# EAGLE design croky_b_1.6_maxi (EAGLE 9.6.1)
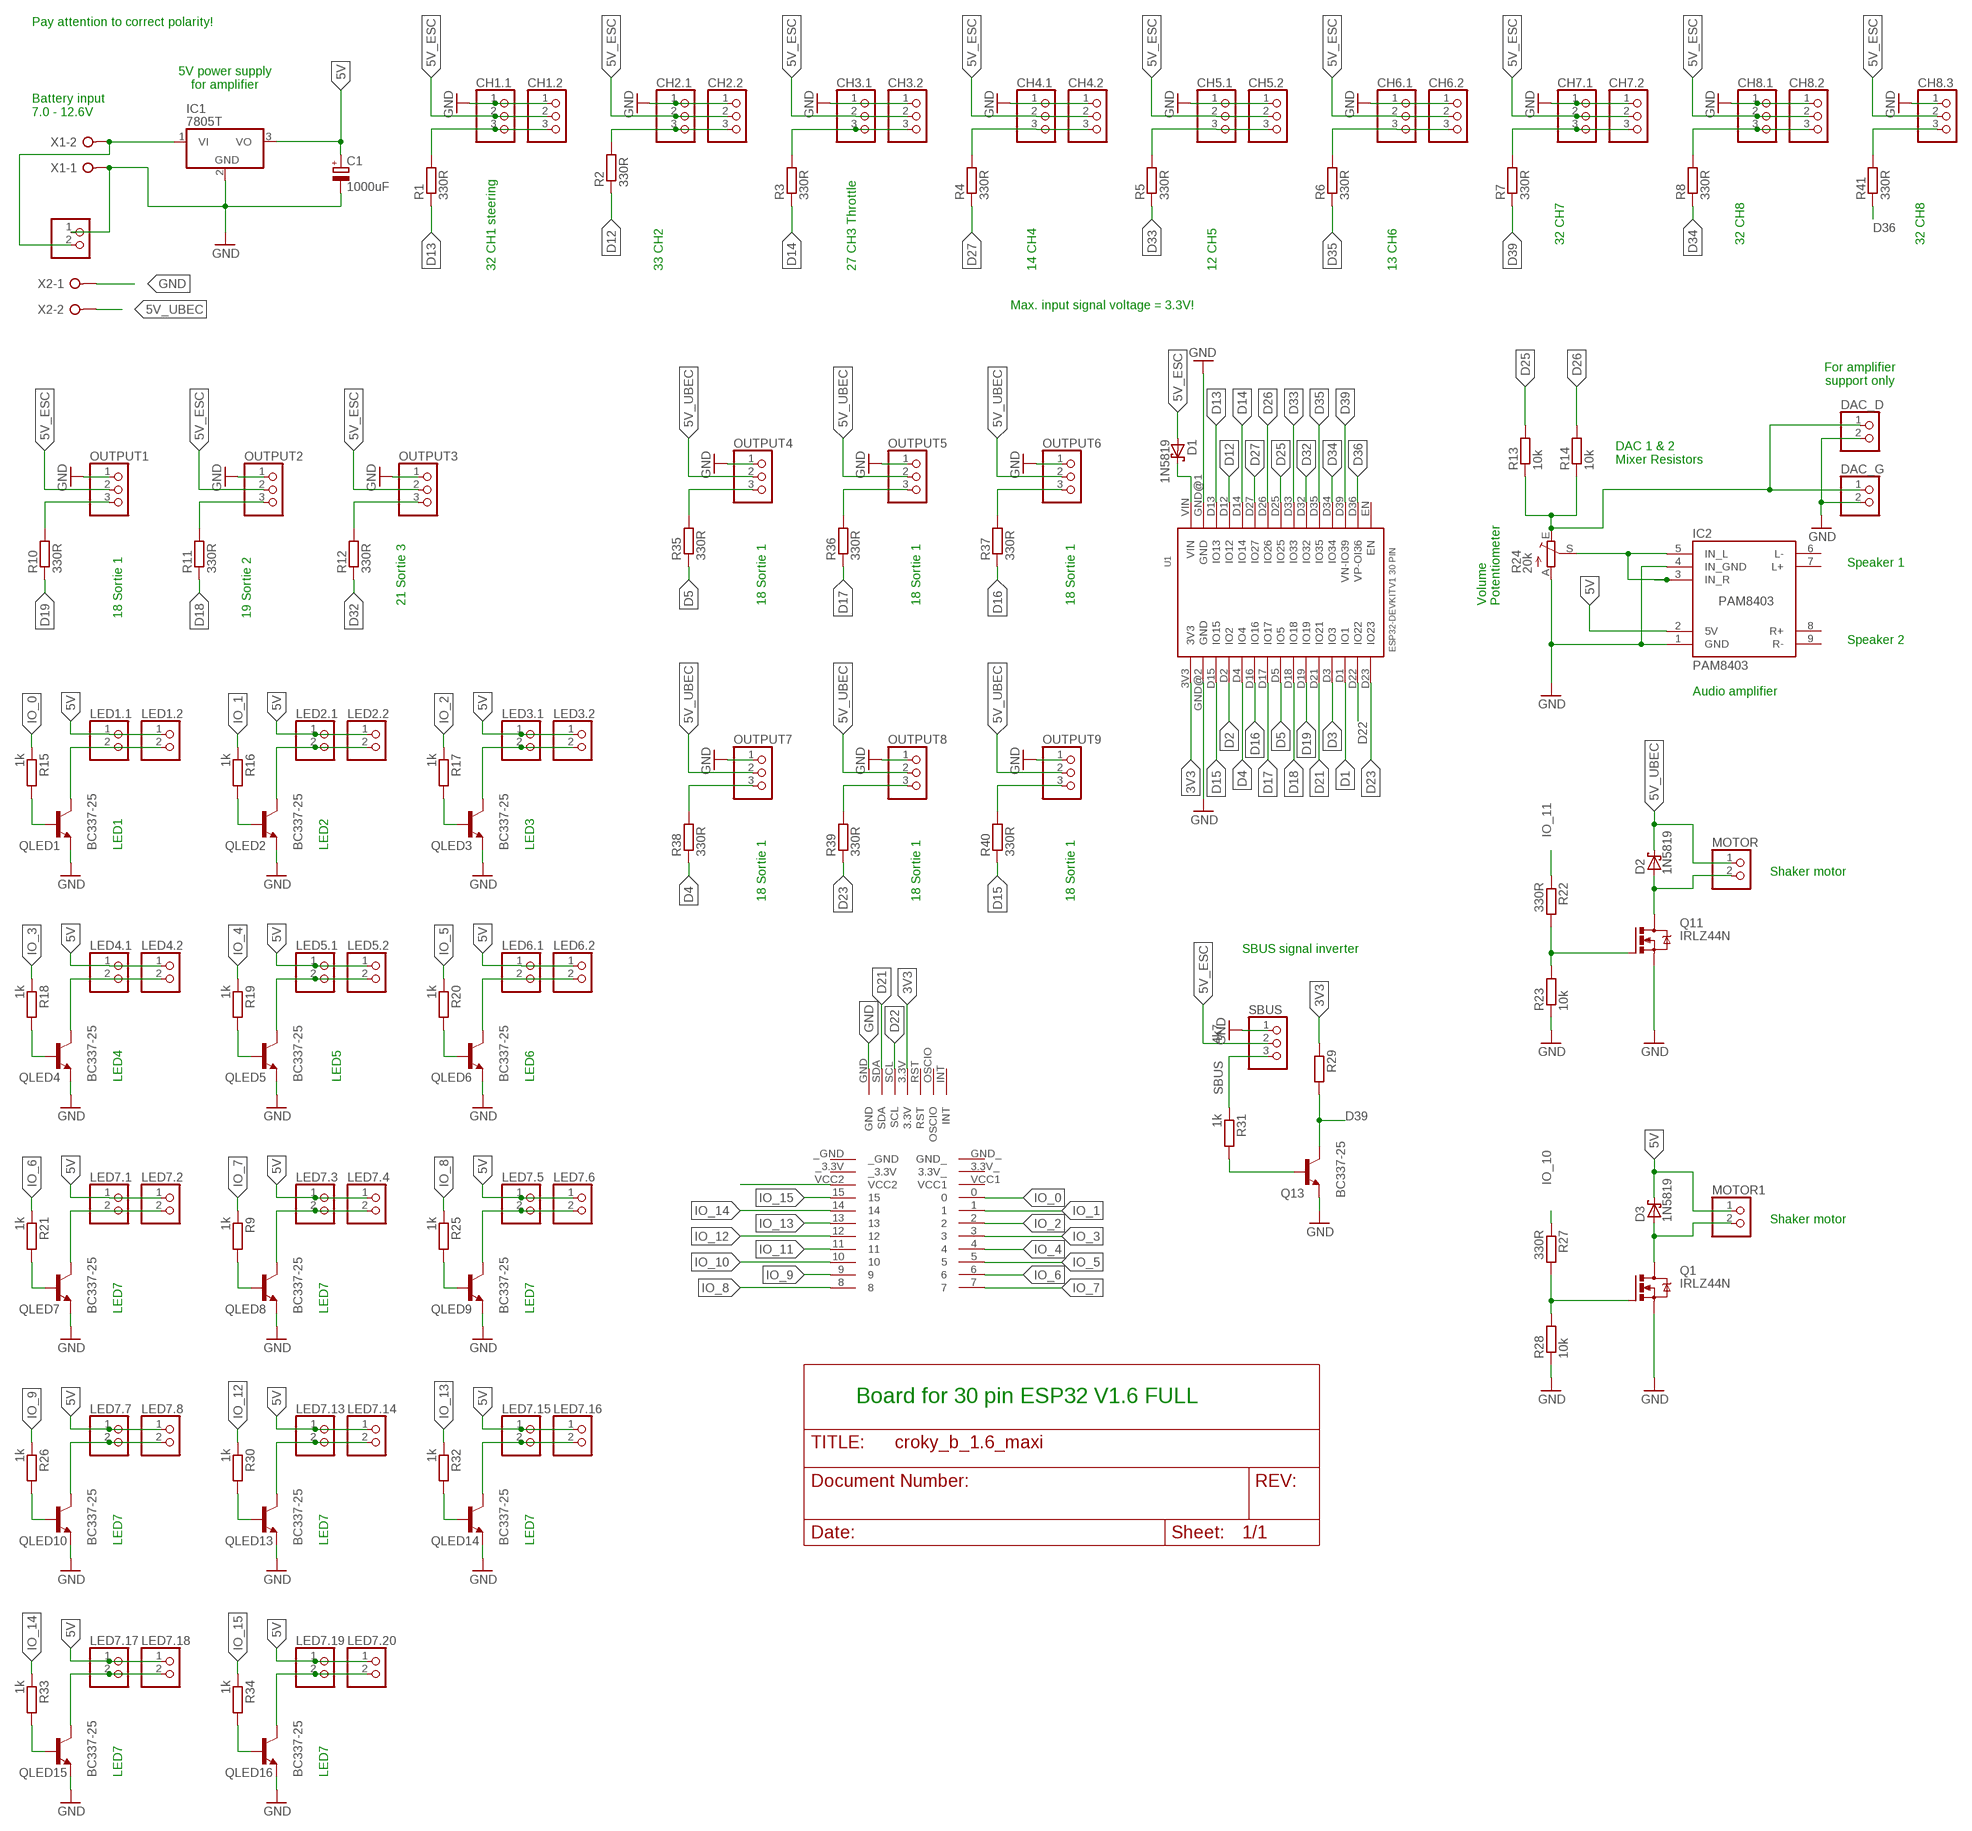
[diagram p0: schematic, sheet 1]

## Parts
C1  1000uF  CPOL-EUE5-10.5  [E5-10,5]
CH1.1  PINHD-1X3  [1X03]
CH1.2  PINHD-1X3  [1X03]
CH2.1  PINHD-1X3  [1X03]
CH2.2  PINHD-1X3  [1X03]
CH3.1  PINHD-1X3  [1X03]
CH3.2  PINHD-1X3  [1X03]
CH4.1  PINHD-1X3  [1X03]
CH4.2  PINHD-1X3  [1X03]
CH5.1  PINHD-1X3  [1X03]
CH5.2  PINHD-1X3  [1X03]
CH6.1  PINHD-1X3  [1X03]
CH6.2  PINHD-1X3  [1X03]
CH7.1  PINHD-1X3  [1X03]
CH7.2  PINHD-1X3  [1X03]
CH8.1  PINHD-1X3  [1X03]
CH8.2  PINHD-1X3  [1X03]
CH8.3  PINHD-1X3  [1X03]
D1  1N5819  SCHOTTKY-DIODEDO35-7  [DO35-7]
D2  1N5819  SCHOTTKY-DIODEDO35-7  [DO35-7]
D3  1N5819  SCHOTTKY-DIODEDO35-7  [DO35-7]
DAC_D  PINHD-1X2  [1X02]
DAC_G  PINHD-1X2  [1X02]
IC1  7805T  [TO220H]
IC2  PAM8403  [PAM8403]
LED1.1  PINHD-1X2  [1X02]
LED1.2  PINHD-1X2  [1X02]
LED2.1  PINHD-1X2  [1X02]
LED2.2  PINHD-1X2  [1X02]
LED3.1  PINHD-1X2  [1X02]
LED3.2  PINHD-1X2  [1X02]
LED4.1  PINHD-1X2  [1X02]
LED4.2  PINHD-1X2  [1X02]
LED5.1  PINHD-1X2  [1X02]
LED5.2  PINHD-1X2  [1X02]
LED6.1  PINHD-1X2  [1X02]
LED6.2  PINHD-1X2  [1X02]
LED7.1  PINHD-1X2  [1X02]
LED7.2  PINHD-1X2  [1X02]
LED7.3  PINHD-1X2  [1X02]
LED7.4  PINHD-1X2  [1X02]
LED7.5  PINHD-1X2  [1X02]
LED7.6  PINHD-1X2  [1X02]
LED7.7  PINHD-1X2  [1X02]
LED7.8  PINHD-1X2  [1X02]
LED7.13  PINHD-1X2  [1X02]
LED7.14  PINHD-1X2  [1X02]
LED7.15  PINHD-1X2  [1X02]
LED7.16  PINHD-1X2  [1X02]
LED7.17  PINHD-1X2  [1X02]
LED7.18  PINHD-1X2  [1X02]
LED7.19  PINHD-1X2  [1X02]
LED7.20  PINHD-1X2  [1X02]
MOTOR  PINHD-1X2  [1X02]
MOTOR1  PINHD-1X2  [1X02]
MOTOR2  PINHD-1X2  [1X02]
OUTPUT1  PINHD-1X3  [1X03]
OUTPUT2  PINHD-1X3  [1X03]
OUTPUT3  PINHD-1X3  [1X03]
OUTPUT4  PINHD-1X3  [1X03]
OUTPUT5  PINHD-1X3  [1X03]
OUTPUT6  PINHD-1X3  [1X03]
OUTPUT7  PINHD-1X3  [1X03]
OUTPUT8  PINHD-1X3  [1X03]
OUTPUT9  PINHD-1X3  [1X03]
Q1  IRLZ44N  IRF540  [TO220BV]
Q11  IRLZ44N  IRF540  [TO220BV]
Q13  BC337-25  [TO92]
QLED1  BC337-25  [TO92]
QLED2  BC337-25  [TO92]
QLED3  BC337-25  [TO92]
QLED4  BC337-25  [TO92]
QLED5  BC337-25  [TO92]
QLED6  BC337-25  [TO92]
QLED7  BC337-25  [TO92]
QLED8  BC337-25  [TO92]
QLED9  BC337-25  [TO92]
QLED10  BC337-25  [TO92]
QLED13  BC337-25  [TO92]
QLED14  BC337-25  [TO92]
QLED15  BC337-25  [TO92]
QLED16  BC337-25  [TO92]
R1  330R  R-EU_0207/2V  [0207/2V]
R2  330R  R-EU_0207/2V  [0207/2V]
R3  330R  R-EU_0207/2V  [0207/2V]
R4  330R  R-EU_0207/2V  [0207/2V]
R5  330R  R-EU_0207/2V  [0207/2V]
R6  330R  R-EU_0207/2V  [0207/2V]
R7  330R  R-EU_0207/2V  [0207/2V]
R8  330R  R-EU_0207/2V  [0207/2V]
R9  1k  R-EU_0207/2V  [0207/2V]
R10  330R  R-EU_0207/2V  [0207/2V]
R11  330R  R-EU_0207/2V  [0207/2V]
R12  330R  R-EU_0207/2V  [0207/2V]
R13  10k  R-EU_0207/10  [0207/10]
R14  10k  R-EU_0207/10  [0207/10]
R15  1k  R-EU_0207/2V  [0207/2V]
R16  1k  R-EU_0207/2V  [0207/2V]
R17  1k  R-EU_0207/2V  [0207/2V]
R18  1k  R-EU_0207/2V  [0207/2V]
R19  1k  R-EU_0207/2V  [0207/2V]
R20  1k  R-EU_0207/2V  [0207/2V]
R21  1k  R-EU_0207/2V  [0207/2V]
R22  330R  R-EU_0207/2V  [0207/2V]
R23  10k  R-EU_0207/2V  [0207/2V]
R24  20k  TRIM_EU-S64W  [S64W]
R25  1k  R-EU_0207/2V  [0207/2V]
R26  1k  R-EU_0207/2V  [0207/2V]
R27  330R  R-EU_0207/2V  [0207/2V]
R28  10k  R-EU_0207/2V  [0207/2V]
R29  4k7  R-EU_0207/2V  [0207/2V]
R30  1k  R-EU_0207/2V  [0207/2V]
R31  1k  R-EU_0207/2V  [0207/2V]
R32  1k  R-EU_0207/2V  [0207/2V]
R33  1k  R-EU_0207/2V  [0207/2V]
R34  1k  R-EU_0207/2V  [0207/2V]
R35  330R  R-EU_0207/2V  [0207/2V]
R36  330R  R-EU_0207/2V  [0207/2V]
R37  330R  R-EU_0207/2V  [0207/2V]
R38  330R  R-EU_0207/2V  [0207/2V]
R39  330R  R-EU_0207/2V  [0207/2V]
R40  330R  R-EU_0207/2V  [0207/2V]
R41  330R  R-EU_0207/2V  [0207/2V]
SBUS  PINHD-1X3  [1X03]
U1  ESP32DEVKITV1  [ESP32-DEVKITV1]
U$1  TEST  [TEST]
X1  W237-02P  [W237-132]
X2  W237-02P  [W237-132]

## Nets
3V3: R29.1 U1.3V3 U$1.3.3V
5V: C1.+ D3.C IC1.3(VO) IC2.2(5V) LED1.1.1 LED1.2.1 LED2.1.1 LED2.2.1 LED3.1.1 LED3.2.1 LED4.1.1 LED4.2.1 LED5.1.1 LED5.2.1 LED6.1.1 LED6.2.1 LED7.1.1 LED7.2.1 LED7.3.1 LED7.4.1 LED7.5.1 LED7.6.1 LED7.7.1 LED7.8.1 LED7.13.1 LED7.14.1 LED7.15.1 LED7.16.1 LED7.17.1 LED7.18.1 LED7.19.1 LED7.20.1 MOTOR1.1
5V_ESC: CH1.1.2 CH1.2.2 CH2.1.2 CH2.2.2 CH3.1.2 CH3.2.2 CH4.1.2 CH4.2.2 CH5.1.2 CH5.2.2 CH6.1.2 CH6.2.2 CH7.1.2 CH7.2.2 CH8.1.2 CH8.2.2 CH8.3.2 D1.A OUTPUT1.2 OUTPUT2.2 OUTPUT3.2 SBUS.2
5V_UBEC: D2.C MOTOR.1 OUTPUT4.2 OUTPUT5.2 OUTPUT6.2 OUTPUT7.2 OUTPUT8.2 OUTPUT9.2 X2.2
-: LED2.1.2 LED2.2.2 QLED2.3(C)
--: LED3.1.2 LED3.2.2 QLED3.3(C)
BAT+: IC1.1(VI) MOTOR2.2 X1.2
D1: U1.D1(IO1)
D2: U1.D2(IO2)
D3: U1.D3(IO3)
D4: R38.1 U1.D4(IO4)
D5: R35.1 U1.D5(IO5)
D12: R2.1 U1.D12(IO12)
D13: R1.1 U1.D13(IO13)
D14: R3.1 U1.D14(IO14)
D15: R40.1 U1.D15(IO15)
D16: R37.1 U1.D16(IO16)
D17: R36.1 U1.D17(IO17)
D18: R11.1 U1.D18(IO18)
D19: R10.1 U1.D19(IO19)
D21: U1.D21(IO21) U$1.SDA
D22: U1.D22(IO22) U$1.SCL
D23: R39.1 U1.D23(IO23)
D25: R13.2 U1.D25(IO25)
D26: R14.2 U1.D26(IO26)
D27: R4.1 U1.D27(IO27)
D32: R12.1 U1.D32(IO32)
D33: R5.1 U1.D33(IO33)
D34: R8.1 U1.D34(IO34)
D35: R6.1 U1.D35(IO35)
D36: R41.1 U1.D36(VP-OI36)
D39: Q13.3(C) R7.1 R29.2 U1.D39(VN-IO39)
GND: C1.- CH1.1.1 CH1.2.1 CH2.1.1 CH2.2.1 CH3.1.1 CH3.2.1 CH4.1.1 CH4.2.1 CH5.1.1 CH5.2.1 CH6.1.1 CH6.2.1 CH7.1.1 CH7.2.1 CH8.1.1 CH8.2.1 CH8.3.1 DAC_D.2 DAC_G.2 IC1.2(GND) IC2.1(GND) IC2.4(IN_GND) MOTOR2.1 OUTPUT1.1 OUTPUT2.1 OUTPUT3.1 OUTPUT4.1 OUTPUT5.1 OUTPUT6.1 OUTPUT7.1 OUTPUT8.1 OUTPUT9.1 Q1.S Q11.S Q13.1(E) QLED1.1(E) QLED2.1(E) QLED3.1(E) QLED4.1(E) QLED5.1(E) QLED6.1(E) QLED7.1(E) QLED8.1(E) QLED9.1(E) QLED10.1(E) QLED13.1(E) QLED14.1(E) QLED15.1(E) QLED16.1(E) R23.1 R24.A R28.1 SBUS.1 U1.GND@1(GND) U1.GND@2(GND) U$1.GND X1.1 X2.1
IO_0: R15.1 U$1.0
IO_1: R16.1 U$1.1
IO_2: R17.1 U$1.2
IO_3: R18.1 U$1.3
IO_4: R19.1 U$1.4
IO_5: R20.1 U$1.5
IO_6: R21.1 U$1.6
IO_7: R9.1 U$1.7
IO_8: R25.1 U$1.8
IO_9: R26.1 U$1.9
IO_10: R27.1 U$1.10
IO_11: R22.1 U$1.11
IO_12: R30.1 U$1.12
IO_13: R32.1 U$1.13
IO_14: R33.1 U$1.14
IO_15: R34.1 U$1.15
N$1: IC2.3(IN_R) IC2.5(IN_L) R24.S
N$2: U$1.VCC2
N$3: CH6.1.3 CH6.2.3 R6.2
N$4: Q11.G R22.2 R23.2
N$5: CH5.1.3 CH5.2.3 R5.2
N$6: CH4.1.3 CH4.2.3 R4.2
N$7: CH7.1.3 CH7.2.3 R7.2
N$8: CH3.1.3 CH3.2.3 R3.2
N$9: D1.C U1.VIN
N$10: CH1.1.3 CH1.2.3 R1.2
N$11: OUTPUT1.3 R10.2
N$12: OUTPUT2.3 R11.2
N$13: OUTPUT3.3 R12.2
N$14: CH2.1.3 CH2.2.3 R2.2
N$15: D2.A MOTOR.2 Q11.D
N$16: QLED1.2(B) R15.2
N$17: QLED6.2(B) R20.2
N$18: LED1.1.2 LED1.2.2 QLED1.3(C)
N$19: LED6.1.2 LED6.2.2 QLED6.3(C)
N$20: DAC_D.1 DAC_G.1 R13.1 R14.1 R24.E
N$21: QLED8.2(B) R9.2
N$22: QLED3.2(B) R17.2
N$23: LED7.3.2 LED7.4.2 QLED8.3(C)
N$24: QLED2.2(B) R16.2
N$25: QLED9.2(B) R25.2
N$26: LED7.5.2 LED7.6.2 QLED9.3(C)
N$27: QLED7.2(B) R21.2
N$28: LED7.1.2 LED7.2.2 QLED7.3(C)
N$29: QLED4.2(B) R18.2
N$30: LED4.1.2 LED4.2.2 QLED4.3(C)
N$31: QLED10.2(B) R26.2
N$32: LED7.7.2 LED7.8.2 QLED10.3(C)
N$33: Q1.G R27.2 R28.2
N$34: D3.A MOTOR1.2 Q1.D
N$35: QLED5.2(B) R19.2
N$36: LED5.1.2 LED5.2.2 QLED5.3(C)
N$37: Q13.2(B) R31.2
N$38: CH8.3.3 R41.2
N$40: QLED13.2(B) R30.2
N$41: CH8.1.3 CH8.2.3 R8.2
N$42: LED7.13.2 LED7.14.2 QLED13.3(C)
N$43: QLED14.2(B) R32.2
N$44: LED7.15.2 LED7.16.2 QLED14.3(C)
N$45: QLED15.2(B) R33.2
N$46: LED7.17.2 LED7.18.2 QLED15.3(C)
N$47: QLED16.2(B) R34.2
N$48: LED7.19.2 LED7.20.2 QLED16.3(C)
N$49: OUTPUT4.3 R35.2
N$50: OUTPUT5.3 R36.2
N$51: OUTPUT6.3 R37.2
N$52: OUTPUT7.3 R38.2
N$53: OUTPUT8.3 R39.2
N$54: OUTPUT9.3 R40.2
SBUS: R31.1 SBUS.3
Unconnected: IC2.6(L-) IC2.7(L+) IC2.8(R+) IC2.9(R-) U1.EN U$1.3.3V_ U$1._3.3V U$1._GND U$1.GND_ U$1.INT U$1.OSCIO U$1.RST U$1.VCC1

## Notes on the sheet
- Pay attention to correct polarity!
- 5V power supply
  for amplifier
- Battery input
  7.0 - 12.6V
- 32 CH7 | 32 CH8 | 32 CH8
- 32 CH1 steering | 33 CH2 | 27 CH3 Throttle | 14 CH4 | 12 CH5 | 13 CH6
- Max. input signal voltage = 3.3V!
- For amplifier
  support only
- DAC 1 & 2
  Mixer Resistors
- Speaker 1
- 21 Sortie 3 | 18 Sortie 1 | 18 Sortie 1 | 18 Sortie 1
- Volume
  Potentiometer
- 18 Sortie 1 | 19 Sortie 2
- Speaker 2
- Audio amplifier
- LED1 | LED2 | LED3
- Shaker motor
- 18 Sortie 1 | 18 Sortie 1 | 18 Sortie 1
- SBUS signal inverter
- LED4 | LED5 | LED6
- Shaker motor
- LED7 | LED7 | LED7
- Board for 30 pin ESP32 V1.6 FULL
- LED7 | LED7 | LED7
- LED7 | LED7

## Library data of the parts
C1 = rcl:CPOL-EU: POLARIZED CAPACITOR, European symbol
CH1.1 CH1.2 CH2.1 CH2.2 CH3.1 CH3.2 CH4.1 CH4.2 CH5.1 CH5.2 CH6.1 CH6.2 CH7.1 CH7.2 CH8.1-CH8.3 OUTPUT1-OUTPUT9 SBUS = 00_custom_pinhead:PINHD-1X3: PIN HEADER
D1-D3 = diode:SCHOTTKY-DIODE: Schottky Diode
DAC_D DAC_G LED1.1 LED1.2 LED2.1 LED2.2 LED3.1 LED3.2 LED4.1 LED4.2 LED5.1 LED5.2 LED6.1 LED6.2 LED7.1-LED7.8 LED7.13-LED7.20 MOTOR MOTOR1 MOTOR2 = 00_custom_pinhead:PINHD-1X2: PIN HEADER
IC1 = linear:78*: Positive VOLTAGE REGULATOR Source: http://cache.national.com/ds/LM/LM78L05.pdf http://www.fairchildsemi.com/ds/LM/LM7805.pdf
IC2 = 00_custom:PAM8403: 2Channel 3W DC 2.5-5V Class D Amplifier Board
Q1 Q11 = transistor-power:IRF540: HEXFET Power MOSFET
Q13 QLED1-QLED10 QLED13-QLED16 = transistor-npn:BC337*: NPN Transistor
R1 R2 R4-R23 R25-R41 = rcl:R-EU_: RESISTOR, European symbol
R3 = rcl:R-EU_: RESISTOR, European symbol; SPICEPREFIX: R
R24 = pot:TRIM_EU-: POTENTIOMETER
U1 = ESP32-DEVKITV1_30pin:ESP32DEVKITV1
U$1 = test:TEST
X1 X2 = con-wago-508:W237-02P: WAGO SREW CLAMP; OC_FARNELL: unknown; OC_NEWARK: unknown

## Net classes
0 5V: clearance 0.254 mm

## Board
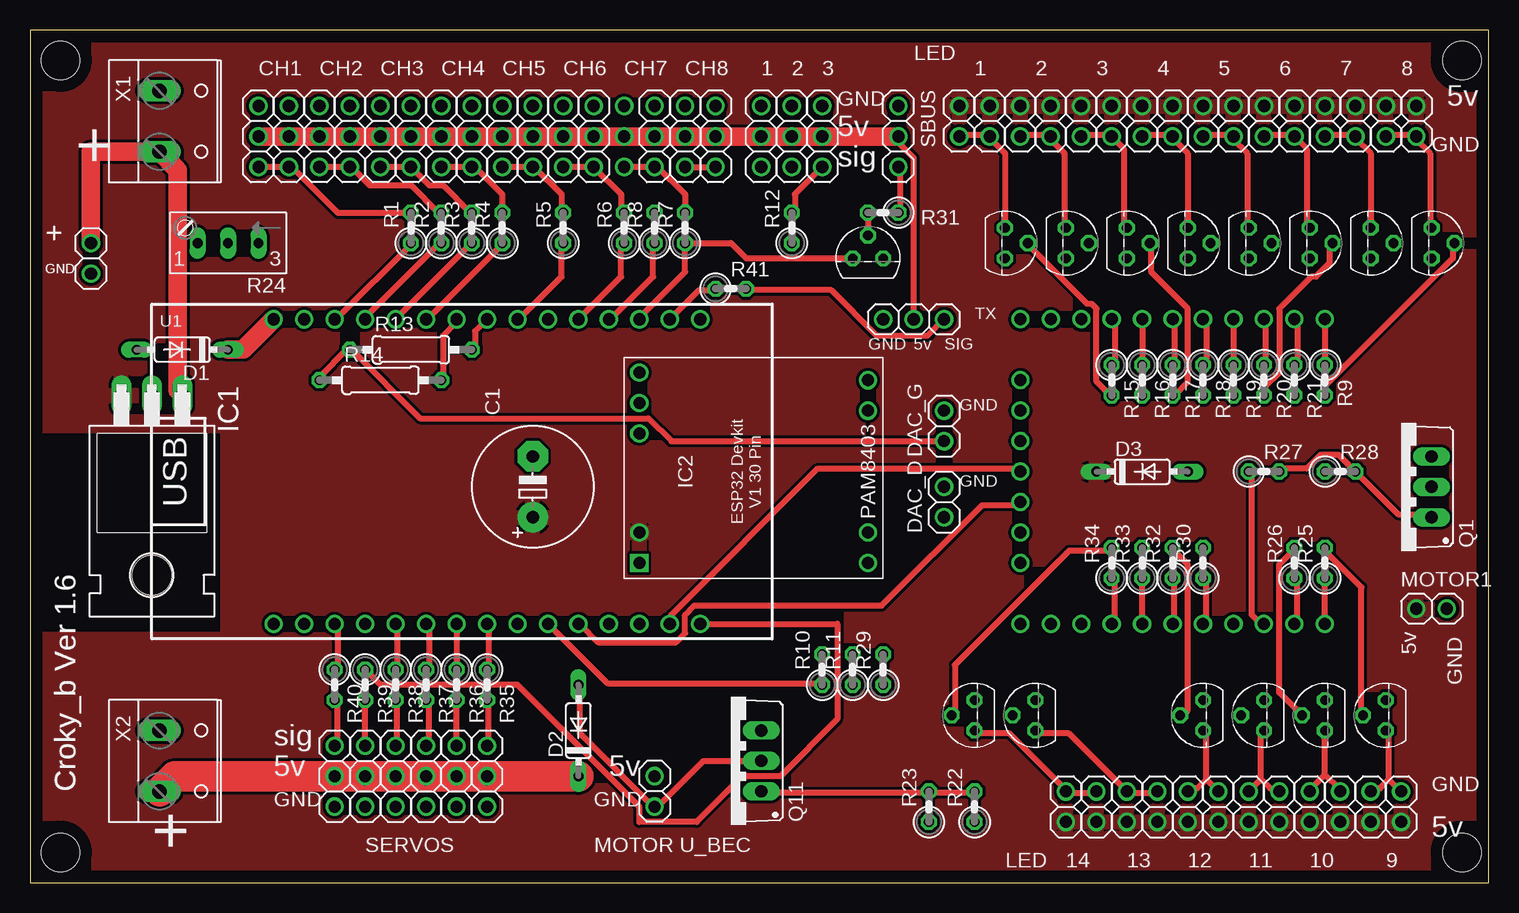
[diagram p1: board, top side]
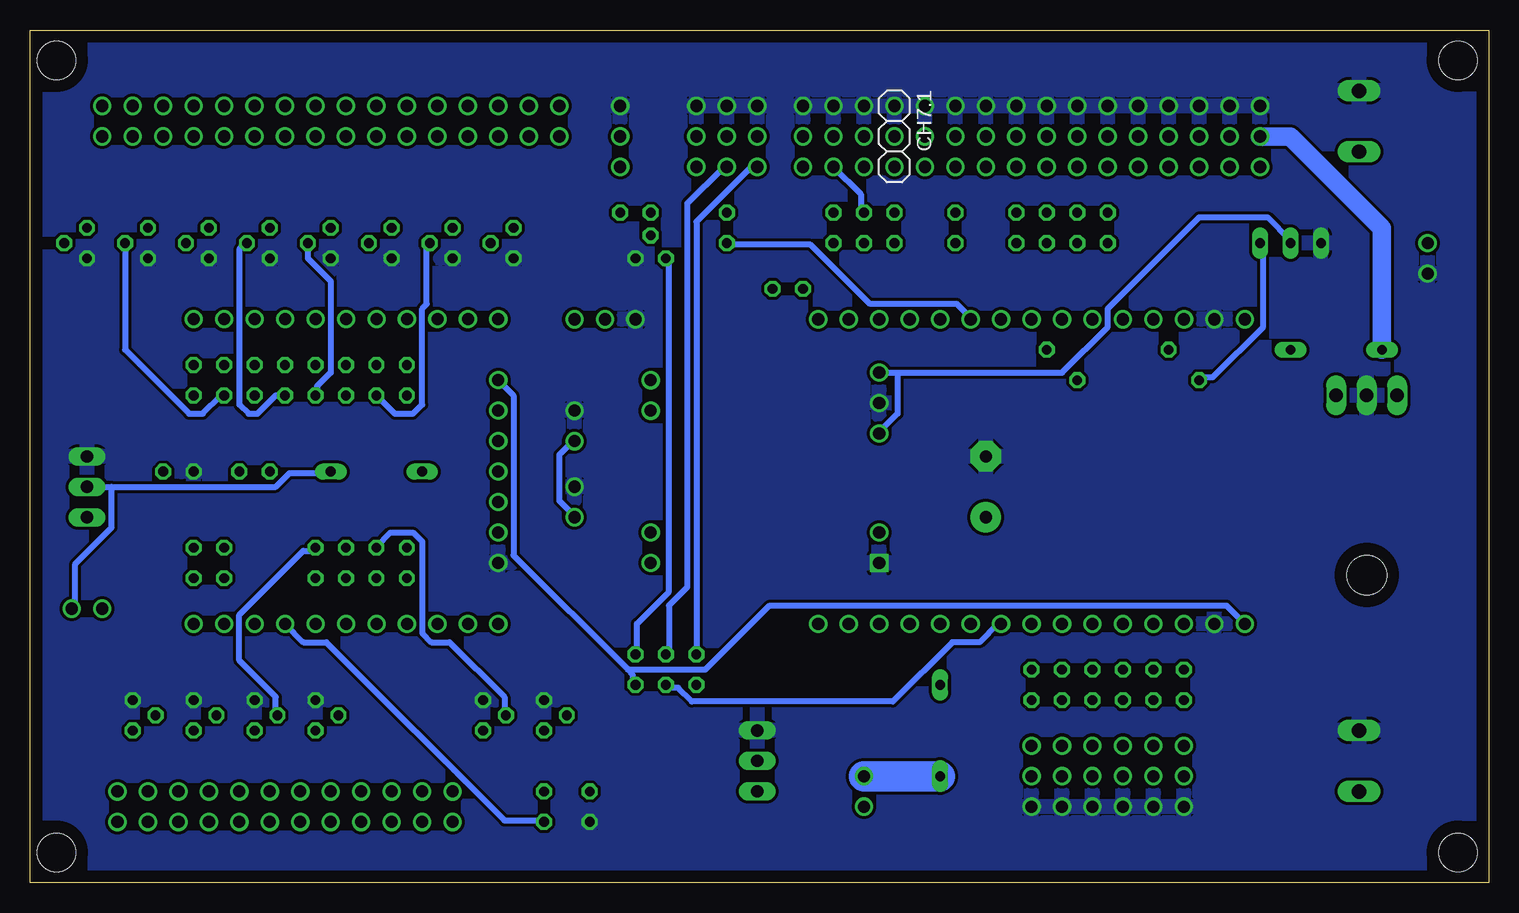
[diagram p2: board, bottom side, seen from below]

Size 121.59 x 71.11 mm. Coordinates in mm from the lower left corner, seen from the top.
Outline: 0,0 121.59,0 121.59,71.11 0,71.11 0,0
Copper layers (1*16): Top 0.035mm / dielectric 1.5mm / Bottom 0.035mm
Design rules "default *": minimum track width 20mil, minimum drill 0.35mm, track to track 6mil, track to pad 6mil, pad to pad 6mil, via to via 6mil, smd to smd 6mil, copper to edge 40mil, drill to drill 6mil, minimum pad ring 10mil, minimum via ring 8mil, stop-mask expansion 4mil, vias tented up to drill 0mil, thermal gap 10mil
Holes 3.2 mm at 2.54,68.58 2.54,2.54 119.38,2.54 119.38,68.58

### Footprints (pad centres in the part's own frame; a part is rotated, then mirrored left to right if it is on the bottom)
E5-10,5 = drill 1.016 pad 2.54: + -2.54,0 | drill 1.016 pad 2.54 octagon: - 2.54,0
1X03 = drill 1.016 pad 1.524: 1 -2.54,0; 2 0,0; 3 2.54,0
DO35-7 = drill 0.813 long: A 3.81,0; C -3.81,0
1X02 = drill 1.016 pad 1.524: 1 -1.27,0; 2 1.27,0
TO220H = drill 1.118 long: 1 -2.54,-10.16; 2 0,-10.16; 3 2.54,-10.16 | hole 3.302: 0,4.826
PAM8403 = drill 1.016 square: 1 -7.62,8.89 | drill 1.016: 2 -5.08,8.89; 3 3.175,8.89; 4 5.715,8.89; 5 8.255,8.89; 6 7.62,-10.16; 7 5.08,-10.16; 8 -5.08,-10.16; 9 -7.62,-10.16
TO220BV = drill 1.016 long: D 0,-2.54; G -2.54,-2.54; S 2.54,-2.54
TO92 = drill 0.813 octagon: 1 1.27,0; 2 0,1.905; 3 -1.27,0
0207/2V = drill 0.813 octagon: 1 -1.27,0; 2 1.27,0
0207/10 = drill 0.813 octagon: 1 -5.08,0; 2 5.08,0
S64W = drill 0.813 long: A 2.54,1.27; E -2.54,1.27; S 0,1.27
ESP32-DEVKITV1 = drill 1.016: 3V3 -16.51,-12.7; D1 13.97,-12.7; D2 -8.89,-12.7; D3 11.43,-12.7; D4 -6.35,-12.7; D5 1.27,-12.7; D12 -8.89,12.7; D13 -11.44,12.7; D14 -6.35,12.7; D15 -11.43,-12.7; D16 -3.81,-12.7; D17 -1.27,-12.7; D18 3.81,-12.7; D19 6.35,-12.7; D21 8.89,-12.7; D22 16.51,-12.7; D23 19.05,-12.7; D25 1.27,12.7; D26 -1.27,12.7; D27 -3.81,12.7; D32 6.35,12.7; D33 3.81,12.7; D34 11.43,12.7; D35 8.89,12.7; D36 16.51,12.7; D39 13.97,12.7; EN 19.05,12.7; GND@1 -13.97,12.7; GND@2 -13.97,-12.7; VIN -16.51,12.7
TEST = drill 1: 0 12.7,-5.08; 1 12.7,-7.62; 2 12.7,-10.16; 3 12.7,-12.7; 3.3V 7.62,2.54; 3.3V_ 12.7,0; 4 12.7,-15.24; 5 12.7,-17.78; 6 12.7,-20.32; 7 12.7,-22.86; 8 -12.7,-22.86; 9 -12.7,-20.32; 10 -12.7,-17.78; 11 -12.7,-15.24; 12 -12.7,-12.7; 13 -12.7,-10.16; 14 -12.7,-7.62; 15 -12.7,-5.08; _3.3V -12.7,0; _GND -12.7,2.54; GND -7.62,2.54; GND_ 12.7,2.54; INT 5.08,2.54; OSCIO 2.54,2.54; RST -5.08,2.54; SCL 0,2.54; SDA -2.54,2.54; VCC1 12.7,-2.54; VCC2 -12.7,-2.54
W237-132 = drill 1.194 long: 1 -2.54,-0.635; 2 2.54,-0.635

### Placement (x,y rotation side)
C1  41.91,33.02 90 top
CH1.1  19.05,62.23 270 top
CH1.2  21.59,62.23 270 top
CH2.1  24.13,62.23 270 top
CH2.2  26.67,62.23 270 top
CH3.1  29.21,62.23 270 top
CH3.2  31.75,62.23 270 top
CH4.1  34.29,62.23 270 top
CH4.2  36.83,62.23 270 top
CH5.1  39.37,62.23 270 top
CH5.2  41.91,62.23 270 top
CH6.1  44.45,62.23 270 top
CH6.2  46.99,62.23 270 top
CH7.1  49.53,62.23 270 bottom
CH7.2  52.07,62.23 270 top
CH8.1  54.61,62.23 270 top
CH8.2  57.15,62.23 270 top
CH8.3  73.66,46.99 0 top
D1  12.7,44.45 180 top
D2  45.72,12.7 90 top
D3  92.71,34.29 0 top
DAC_D  76.2,31.75 90 top
DAC_G  76.2,38.1 90 top
IC1  10.16,30.48 180 top
IC2  59.69,34.29 90 top
LED1.1  77.47,63.5 270 top
LED1.2  80.01,63.5 270 top
LED2.1  82.55,63.5 270 top
LED2.2  85.09,63.5 270 top
LED3.1  87.63,63.5 270 top
LED3.2  90.17,63.5 270 top
LED4.1  92.71,63.5 270 top
LED4.2  95.25,63.5 270 top
LED5.1  97.79,63.5 270 top
LED5.2  100.33,63.5 270 top
LED6.1  102.87,63.5 270 top
LED6.2  105.41,63.5 270 top
LED7.1  107.95,63.5 270 top
LED7.2  110.49,63.5 270 top
LED7.3  113.03,63.5 270 top
LED7.4  115.57,63.5 270 top
LED7.5  114.3,6.35 90 top
LED7.6  111.76,6.35 90 top
LED7.7  109.22,6.35 90 top
LED7.8  106.68,6.35 90 top
LED7.13  104.14,6.35 90 top
LED7.14  101.6,6.35 90 top
LED7.15  99.06,6.35 90 top
LED7.16  96.52,6.35 90 top
LED7.17  93.98,6.35 90 top
LED7.18  91.44,6.35 90 top
LED7.19  88.9,6.35 90 top
LED7.20  86.36,6.35 90 top
MOTOR  52.07,7.62 270 top
MOTOR1  116.84,22.86 0 top
MOTOR2  5.08,52.07 90 top
OUTPUT1  60.96,62.23 270 top
OUTPUT2  63.5,62.23 270 top
OUTPUT3  66.04,62.23 270 top
OUTPUT4  38.1,8.89 90 top
OUTPUT5  35.56,8.89 90 top
OUTPUT6  33.02,8.89 90 top
OUTPUT7  30.48,8.89 90 top
OUTPUT8  27.94,8.89 90 top
OUTPUT9  25.4,8.89 90 top
Q1  114.3,33.02 90 top
Q11  58.42,10.16 90 top
Q13  69.85,52.07 0 top
QLED1  81.28,53.34 270 top
QLED2  86.36,53.34 270 top
QLED3  91.44,53.34 270 top
QLED4  96.52,53.34 270 top
QLED5  101.6,53.34 270 top
QLED6  106.68,53.34 270 top
QLED7  111.76,53.34 270 top
QLED8  116.84,53.34 270 top
QLED9  113.03,13.97 90 top
QLED10  107.95,13.97 90 top
QLED13  102.87,13.97 90 top
QLED14  97.79,13.97 90 top
QLED15  83.82,13.97 90 top
QLED16  78.74,13.97 90 top
R1  31.75,54.61 90 top
R2  34.29,54.61 90 top
R3  36.83,54.61 90 top
R4  39.37,54.61 90 top
R5  44.45,54.61 90 top
R6  49.53,54.61 90 top
R7  54.61,54.61 90 top
R8  52.07,54.61 90 top
R9  107.95,41.91 270 top
R10  66.04,17.78 90 top
R11  68.58,17.78 90 top
R12  63.5,54.61 90 top
R13  31.75,44.45 0 top
R14  29.21,41.91 0 top
R15  90.17,41.91 270 top
R16  92.71,41.91 270 top
R17  95.25,41.91 270 top
R18  97.79,41.91 270 top
R19  100.33,41.91 270 top
R20  102.87,41.91 270 top
R21  105.41,41.91 270 top
R22  78.74,6.35 90 top
R23  74.93,6.35 90 top
R24  16.51,54.61 180 top
R25  107.95,26.67 90 top
R26  105.41,26.67 90 top
R27  102.87,34.29 0 top
R28  109.22,34.29 0 top
R29  71.12,17.78 90 top
R30  97.79,26.67 90 top
R31  71.12,55.88 180 top
R32  95.25,26.67 90 top
R33  92.71,26.67 90 top
R34  90.17,26.67 90 top
R35  38.1,16.51 270 top
R36  35.56,16.51 270 top
R37  33.02,16.51 270 top
R38  30.48,16.51 270 top
R39  27.94,16.51 270 top
R40  25.4,16.51 270 top
R41  58.42,49.53 0 top
SBUS  72.39,62.23 270 top
U1  36.83,34.29 0 top
U$1  85.09,34.29 90 top
X1  11.43,63.5 270 top
X2  11.43,10.16 270 top

### Tracks (layer width: path | path; a pad name or v marks a point on that pad's centre or on a via)
3V3
  Bottom 0.508: 71.76,17.78 81.28,27.3 81.28,40.64 U$1.3.3V | 71.76,17.78 71.37,17.4 71.37,16.64 R29.1 | U1.3V3 21.84,23.11 59.94,23.11 65.28,17.78 71.76,17.78
5V
  pour Top: -1.27,71.12 121.92,71.12 121.92,-2.54 -2.54,-2.54 -2.54,20.32 16.51,20.32 16.51,38.1 -1.27,38.1
5V_ESC
  Top 0.508: CH8.3.2 73.66,60.45 72.52,61.59 SBUS.2
  Top 1.524: CH1.1.2 CH1.2.2 CH2.1.2 CH2.2.2 CH3.1.2 CH3.2.2 CH4.1.2 CH4.2.2 CH5.1.2 CH5.2.2 CH6.1.2 CH6.2.2 CH7.1.2 CH7.2.2 CH8.1.2 CH8.2.2 OUTPUT1.2 OUTPUT2.2 OUTPUT3.2 SBUS.2
  Bottom 1.524: CH1.1.2 16.51,62.23 8.89,54.61 D1.A
5V_UBEC
  Top 1.524: OUTPUT8.2 OUTPUT7.2 OUTPUT6.2 OUTPUT5.2 OUTPUT4.2 D2.C
  Top 2.54: OUTPUT9.2 OUTPUT8.2 | OUTPUT9.2 OUTPUT7.2 | OUTPUT9.2 OUTPUT6.2 | OUTPUT9.2 OUTPUT5.2 | OUTPUT9.2 OUTPUT4.2 | OUTPUT9.2 D2.C | X2.2 12.07,8.89 OUTPUT9.2
  Bottom 2.54: D2.C MOTOR.1
-
  Top 0.508: QLED2.3 86.23,54.74 86.23,60.83 85.09,61.98 LED2.2.2 85.09,62.36 82.8,62.36 LED2.1.2
--
  Top 0.508: QLED3.3 91.19,54.74 91.19,61.21 LED3.2.2 90.04,62.36 87.76,62.36 LED3.1.2
BAT+
  Top 0.508: 12.32,59.31 10.79,60.83 X1.2
  Top 1.524: IC1.1 12.29,41.05 12.29,54.7 12.32,54.72 12.32,59.31 12.32,59.44 X1.2 5.08,60.96 MOTOR2.2
D4
  Top 0.508: R38.1 30.61,17.78 30.61,21.59 U1.D4
D5
  Top 0.508: R35.1 38.23,17.78 38.23,21.59 U1.D5
D12
  Top 0.508: R2.1 34.04,53.21 27.94,47.12 U1.D12
D13
  Top 0.508: R1.1 31.75,53.21 25.65,47.12 U1.D13
D14
  Top 0.508: U1.D14 R3.1
D15
  Top 0.508: R40.1 25.65,17.78 25.65,21.59 U1.D15
D16
  Top 0.508: R37.1 33.27,17.78 33.27,21.59 U1.D16
D17
  Top 0.508: U1.D17 R36.1
D18
  Bottom 0.508: R11.1 68.33,16.26 67.56,16.26 66.42,15.11 49.66,15.11 44.7,20.07 42.42,20.07 40.89,21.59 U1.D18
D19
  Top 0.508: U1.D19 48.13,16.64 66.04,16.64 R10.1
D21
  Top 0.508: U$1.SDA 82.42,31.5 79.38,31.5 70.99,23.11 55.37,23.11 54.61,22.35 54.61,20.83 53.85,20.07 47.37,20.07 45.85,21.59 U1.D21
D22
  Top 0.508: U$1.SCL 82.42,34.54 65.66,34.54 53.47,22.35 53.47,21.59 U1.D22
D23
  Top 0.508: R39.1 29.21,16.51 40.64,16.51 50.8,6.35 50.8,5.08 55.56,5.08 59.37,8.89 62.55,8.89 67.31,13.65 67.31,21.59 U1.D23
D25
  Top 0.508: U1.D25 37.08,45.97 37.08,44.45 R13.2
D26
  Top 0.508: R14.2 34.42,42.16 34.42,45.59 35.56,46.74 U1.D26
D27
  Top 0.508: R4.1 39.37,53.21 33.27,47.12 U1.D27
D32
  Bottom 0.508: R12.1 63.37,53.21 56.52,53.21 51.56,48.26 44.32,48.26 43.18,47.12 U1.D32
D33
  Top 0.508: R5.1 44.32,53.21 44.32,50.55 40.89,47.12 U1.D33
D34
  Top 0.508: R8.1 51.94,53.21 51.94,50.55 48.51,47.12 U1.D34
D35
  Top 0.508: U1.D35 49.28,50.55 49.28,53.21 R6.1
D36
  Top 0.508: U1.D36 55.75,49.4 56.9,49.4 R41.1
D39
  Top 0.508: U1.D39 50.8,47.12 54.61,50.93 R7.1 58.42,53.34 59.69,52.07 Q13.3
  Bottom 0.508: Q13.3 68.33,52.07 68.33,24.26 70.99,21.59 70.99,19.3 R29.2
GND
  pour Bottom: -2.54,71.12 -2.54,-2.54 121.92,-2.54 121.92,71.12
IO_0
  Top 0.508: R15.1 90.42,43.31 90.42,46.74 U$1.0
IO_1
  Top 0.508: U$1.1 R16.1
IO_2
  Top 0.508: R17.1 95.38,43.31 95.38,46.74 U$1.2
IO_3
  Top 0.508: R18.1 98.04,43.31 98.04,46.74 U$1.3
IO_4
  Top 0.508: U$1.4 R19.1
IO_5
  Top 0.508: R20.1 103,43.31 103,46.74 U$1.5
IO_6
  Top 0.508: R21.1 105.66,43.31 105.66,46.74 U$1.6
IO_7
  Top 0.508: U$1.7 R9.1
IO_8
  Top 0.508: U$1.8 R25.1
IO_9
  Top 0.508: R26.1 105.66,25.4 105.66,21.59 U$1.9
IO_10
  Top 0.508: R27.1 101.85,34.16 101.85,22.35 102.62,21.59 U$1.10
IO_11
  Bottom 0.508: U$1.11 98.81,20.07 96.9,20.07 82.04,5.21 78.99,5.21 R22.1
IO_12
  Top 0.508: R30.1 98.04,25.4 98.04,21.59 U$1.12
IO_13
  Top 0.508: R32.1 95.38,25.4 95.38,21.59 U$1.13
IO_14
  Top 0.508: U$1.14 R33.1
IO_15
  Top 0.508: R34.1 90.42,25.4 90.42,21.59 U$1.15
N$1
  Bottom 0.508: IC2.5 49.28,42.55 | 49.28,42.55 35.56,42.55 31.75,46.36 31.75,47.88 24.13,55.5 18.41,55.5 16.51,53.59 R24.S | 49.28,42.55 49.28,39.12 50.8,37.59 IC2.3
N$3
  Top 0.508: R6.2 49.28,55.88 49.28,57.4 CH6.2.3 CH6.1.3
N$4
  Top 0.508: R22.2 78.61,7.49 75.18,7.49 R23.2 74.8,7.49 61.09,7.49 Q11.G
N$5
  Top 0.508: R5.2 44.32,55.88 44.32,57.4 42.04,59.69 CH5.2.3 CH5.1.3
N$6
  Top 0.508: R4.2 39.37,57.4 37.08,59.69 CH4.2.3 CH4.1.3
N$7
  Top 0.508: R7.2 54.61,57.4 52.32,59.69 CH7.2.3 CH7.1.3
N$8
  Top 0.508: R3.2 36.7,55.88 34.42,58.17 33.27,58.17 CH3.2.3 CH3.1.3
N$9
  Top 1.524: U1.VIN 17.78,44.45 D1.C
N$10
  Top 0.508: R1.2 25.65,55.88 21.84,59.69 CH1.2.3 CH1.1.3
N$11
  Bottom 0.508: R10.2 66.04,55.12 61.47,59.69 OUTPUT1.3
N$12
  Bottom 0.508: R11.2 68.33,19.3 68.33,23.11 66.8,24.64 66.8,56.64 63.75,59.69 OUTPUT2.3
N$13
  Top 0.508: OUTPUT3.3 63.75,57.4 63.75,55.88 R12.2
N$14
  Top 0.508: R2.2 34.04,55.88 31.75,58.17 28.32,58.17 26.8,59.69 CH2.2.3 CH2.1.3
N$15
  Top 0.508: D2.A 45.85,16.26 45.85,12.45 51.94,6.35 MOTOR.2 52.32,6.35 56.13,10.16 Q11.D
N$16
  Top 0.508: QLED1.2 83.19,53.21 88.14,48.26 88.52,48.26 88.9,47.88 88.9,41.78 90.04,40.64 R15.2
N$17
  Top 0.508: R20.2 103,40.64 103,41.4 104.14,42.55 104.14,47.88 106.81,50.55 107.19,50.55 108.33,51.69 108.33,53.21 QLED6.2
N$18
  Top 0.508: QLED1.3 81.28,60.83 80.14,61.98 LED1.2.2 79.76,62.36 77.47,62.36 LED1.1.2
N$19
  Top 0.508: QLED6.3 106.43,54.74 106.43,61.21 LED6.2.2 105.28,62.36 103,62.36 LED6.1.2
N$20
  Top 0.508: R14.1 24.13,42.16 26.42,44.45 R13.1 26.8,44.45 32.51,38.73 51.56,38.73 53.47,36.83 DAC_G.1
  Bottom 0.508: DAC_D.1 76.33,30.73 77.47,31.88 77.47,35.69 76.33,36.83 DAC_G.1 | R24.E 18.8,53.21 18.8,46.36 22.99,42.16 24.13,42.16 R14.1
N$21
  Top 0.508: R9.2 107.95,41.4 118.62,52.07 118.62,53.21 QLED8.2
N$22
  Top 0.508: QLED3.2 93.47,53.21 93.47,50.93 96.52,47.88 96.52,41.78 95.38,40.64 R17.2
N$23
  Top 0.508: QLED8.3 116.71,54.74 116.71,60.83 115.57,61.98 LED7.4.2 115.57,62.36 113.28,62.36 LED7.3.2
N$24
  Bottom 0.508: R16.2 91.19,39.12 89.66,39.12 88.9,39.88 88.9,47.88 88.52,48.26 88.52,53.21 QLED2.2
N$25
  Top 0.508: R25.2 107.95,27.69 111,24.64 111,13.97 QLED9.2
N$26
  Top 0.508: 113.28,8.64 113.28,12.45 QLED9.3 | LED7.5.2 113.28,8.64 | 113.28,8.64 112.52,7.87 111.76,7.87 LED7.6.2
N$27
  Bottom 0.508: QLED7.2 113.67,44.45 108.33,39.12 107.19,39.12 105.66,40.64 R21.2
N$28
  Top 0.508: QLED7.3 111.76,60.83 110.62,61.98 LED7.2.2 110.24,62.36 107.95,62.36 LED7.1.2
N$29
  Bottom 0.508: QLED4.2 98.42,52.07 96.52,50.16 96.52,42.55 97.66,41.4 97.66,40.64 R18.2
N$30
  Top 0.508: QLED4.3 96.52,60.83 95.38,61.98 LED4.2.2 95,62.36 92.71,62.36 LED4.1.2
N$31
  Top 0.508: QLED10.2 104.14,15.87 104.14,26.54 105.28,27.69 R26.2
N$32
  Top 0.508: 107.95,9.02 QLED10.3 | 107.95,9.02 106.81,7.87 LED7.8.2 | 107.95,9.02 109.09,7.87 LED7.7.2
N$33
  Top 0.508: R27.2 104.14,34.54 106.43,34.54 107.57,35.69 109.09,35.69 R28.2 114.05,30.73 116.71,30.73 Q1.G
N$34
  Bottom 0.508: Q1.D 114.81,33.02 | 114.81,33.02 101.09,33.02 99.95,34.16 96.52,34.16 D3.A | 114.81,33.02 114.81,29.59 117.86,26.54 117.86,23.11 MOTOR1.2
N$35
  Bottom 0.508: R19.2 101.09,40.64 102.62,39.12 103.38,39.12 104.14,39.88 104.14,52.83 103.76,53.21 QLED5.2
N$36
  Top 0.508: QLED5.3 101.47,54.74 101.47,60.83 100.33,61.98 LED5.2.2 100.33,62.36 98.04,62.36 LED5.1.2
N$37
  Top 0.508: R31.2 Q13.2
N$38
  Top 0.508: CH8.3.3 74.8,45.59 70.61,45.59 66.8,49.4 59.94,49.4 R41.2
N$40
  Bottom 0.508: R30.2 98.04,27.69 98.81,27.69 104.14,22.35 104.14,18.54 101.09,15.49 101.09,13.97 QLED13.2
N$41
  Top 0.508: CH8.1.3 CH8.2.3
  Bottom 0.508: CH8.1.3 52.32,57.4 52.32,55.88 R8.2
N$42
  Top 0.508: 102.62,8.64 102.62,12.45 QLED13.3 | LED7.14.2 102.62,8.64 | 102.62,8.64 103.38,7.87 104.14,7.87 LED7.13.2
N$43
  Top 0.508: R32.2 95.38,27.69 96.52,26.54 96.52,14.35 96.14,13.97 QLED14.2
N$44
  Top 0.508: 98.04,8.64 98.04,12.45 QLED14.3 | LED7.15.2 98.04,8.64 | 98.04,8.64 97.28,7.87 96.52,7.87 LED7.16.2
N$45
  Bottom 0.508: QLED15.2 82.04,13.97 82.04,15.49 86.61,20.07 88.14,20.07 88.9,20.83 88.9,28.45 89.66,29.21 91.57,29.21 92.71,28.07 R33.2
N$46
  Top 0.508: QLED15.3 83.95,12.45 86.61,12.45 LED7.18.2 91.57,7.49 93.85,7.49 LED7.17.2
N$47
  Top 0.508: QLED16.2 77.09,13.97 77.09,18.16 86.61,27.69 90.04,27.69 R34.2
N$48
  Top 0.508: QLED16.3 78.99,12.45 81.66,12.45 86.23,7.87 LED7.20.2 86.61,7.49 88.9,7.49 LED7.19.2
N$49
  Top 0.508: R35.2 38.23,15.11 38.23,11.68 OUTPUT4.3
N$50
  Top 0.508: OUTPUT5.3 R36.2
N$51
  Top 0.508: R37.2 33.27,15.11 33.27,11.68 OUTPUT6.3
N$52
  Top 0.508: R38.2 30.61,15.11 30.61,11.68 OUTPUT7.3
N$53
  Top 0.508: OUTPUT8.3 R39.2
N$54
  Top 0.508: R40.2 25.65,15.11 25.65,11.68 OUTPUT9.3
SBUS
  Top 0.508: R31.1 72.52,55.88 72.52,59.69 SBUS.3

### Text on the board
tPlace: LED | CH1 | CH2 | CH3 | CH4 | CH5 | CH6 | CH7 | CH8 | 1 | 2 | 3 | 1 | 2 | 3 | 4 | 5 | 6 | 7 | 8 | GND | 5v | 5v | GND | + | sig | + | + | GND | GND | TX | GND | 5v | SIG | GND | GND | 5v | GND | sig | 5v | 5v | Croky_b Ver 1.6 | Croky_b Ver 1.6 | GND | GND | GND | 5v | + | SERVOS | MOTOR U_BEC | LED | 14 | 13 | 12 | 11 | 10 | 9